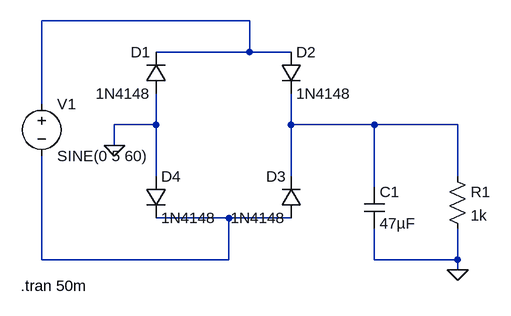
[diagram p0: schematic Full_Bridge.asc]
Full_Bridge.asc, the LTspice schematic file:
Version 4
SHEET 1 880 680
WIRE 224 -48 -96 -48
WIRE 224 0 224 -48
WIRE 224 0 80 0
WIRE 288 0 224 0
WIRE -96 80 -96 -48
WIRE 80 112 80 64
WIRE 80 112 16 112
WIRE 288 112 288 64
WIRE 416 112 288 112
WIRE 544 112 416 112
WIRE 16 144 16 112
WIRE 80 192 80 112
WIRE 288 192 288 112
WIRE 544 192 544 112
WIRE 416 208 416 112
WIRE 192 256 80 256
WIRE 288 256 192 256
WIRE -96 320 -96 160
WIRE 192 320 192 256
WIRE 192 320 -96 320
WIRE 416 320 416 272
WIRE 544 320 544 272
WIRE 544 320 416 320
WIRE 544 336 544 320
FLAG 16 144 0
FLAG 544 336 0
SYMBOL diode 96 64 R180
WINDOW 0 24 64 Left 2
WINDOW 3 24 0 Left 2
SYMATTR InstName D1
SYMATTR Value 1N4148
SYMBOL diode 272 0 R0
SYMATTR InstName D2
SYMATTR Value 1N4148
SYMBOL diode 304 256 R180
WINDOW 0 24 64 Left 2
WINDOW 3 24 0 Left 2
SYMATTR InstName D3
SYMATTR Value 1N4148
SYMBOL diode 64 192 R0
SYMATTR InstName D4
SYMATTR Value 1N4148
SYMBOL voltage -96 64 R0
WINDOW 123 0 0 Left 0
WINDOW 39 0 0 Left 0
SYMATTR InstName V1
SYMATTR Value SINE(0 5 60)
SYMBOL res 528 176 R0
SYMATTR InstName R1
SYMATTR Value 1k
SYMBOL cap 400 208 R0
SYMATTR InstName C1
SYMATTR Value 47µF
TEXT -128 360 Left 2 !.tran 50m

The netlist it stands for:
* Full_Bridge.asc
D1 0 N001 1N4148
D2 N001 N002 1N4148
D3 N003 N002 1N4148
D4 0 N003 1N4148
V1 N001 N003 SINE(0 5 60)
R1 N002 0 1k
C1 N002 0 47µF
.model D D
.lib standard.dio
.tran 50m
.backanno
.end